# Altium schematic sheet ESC_D.SchDoc
size A3; SheetNumber: 10; SheetTotal: 10
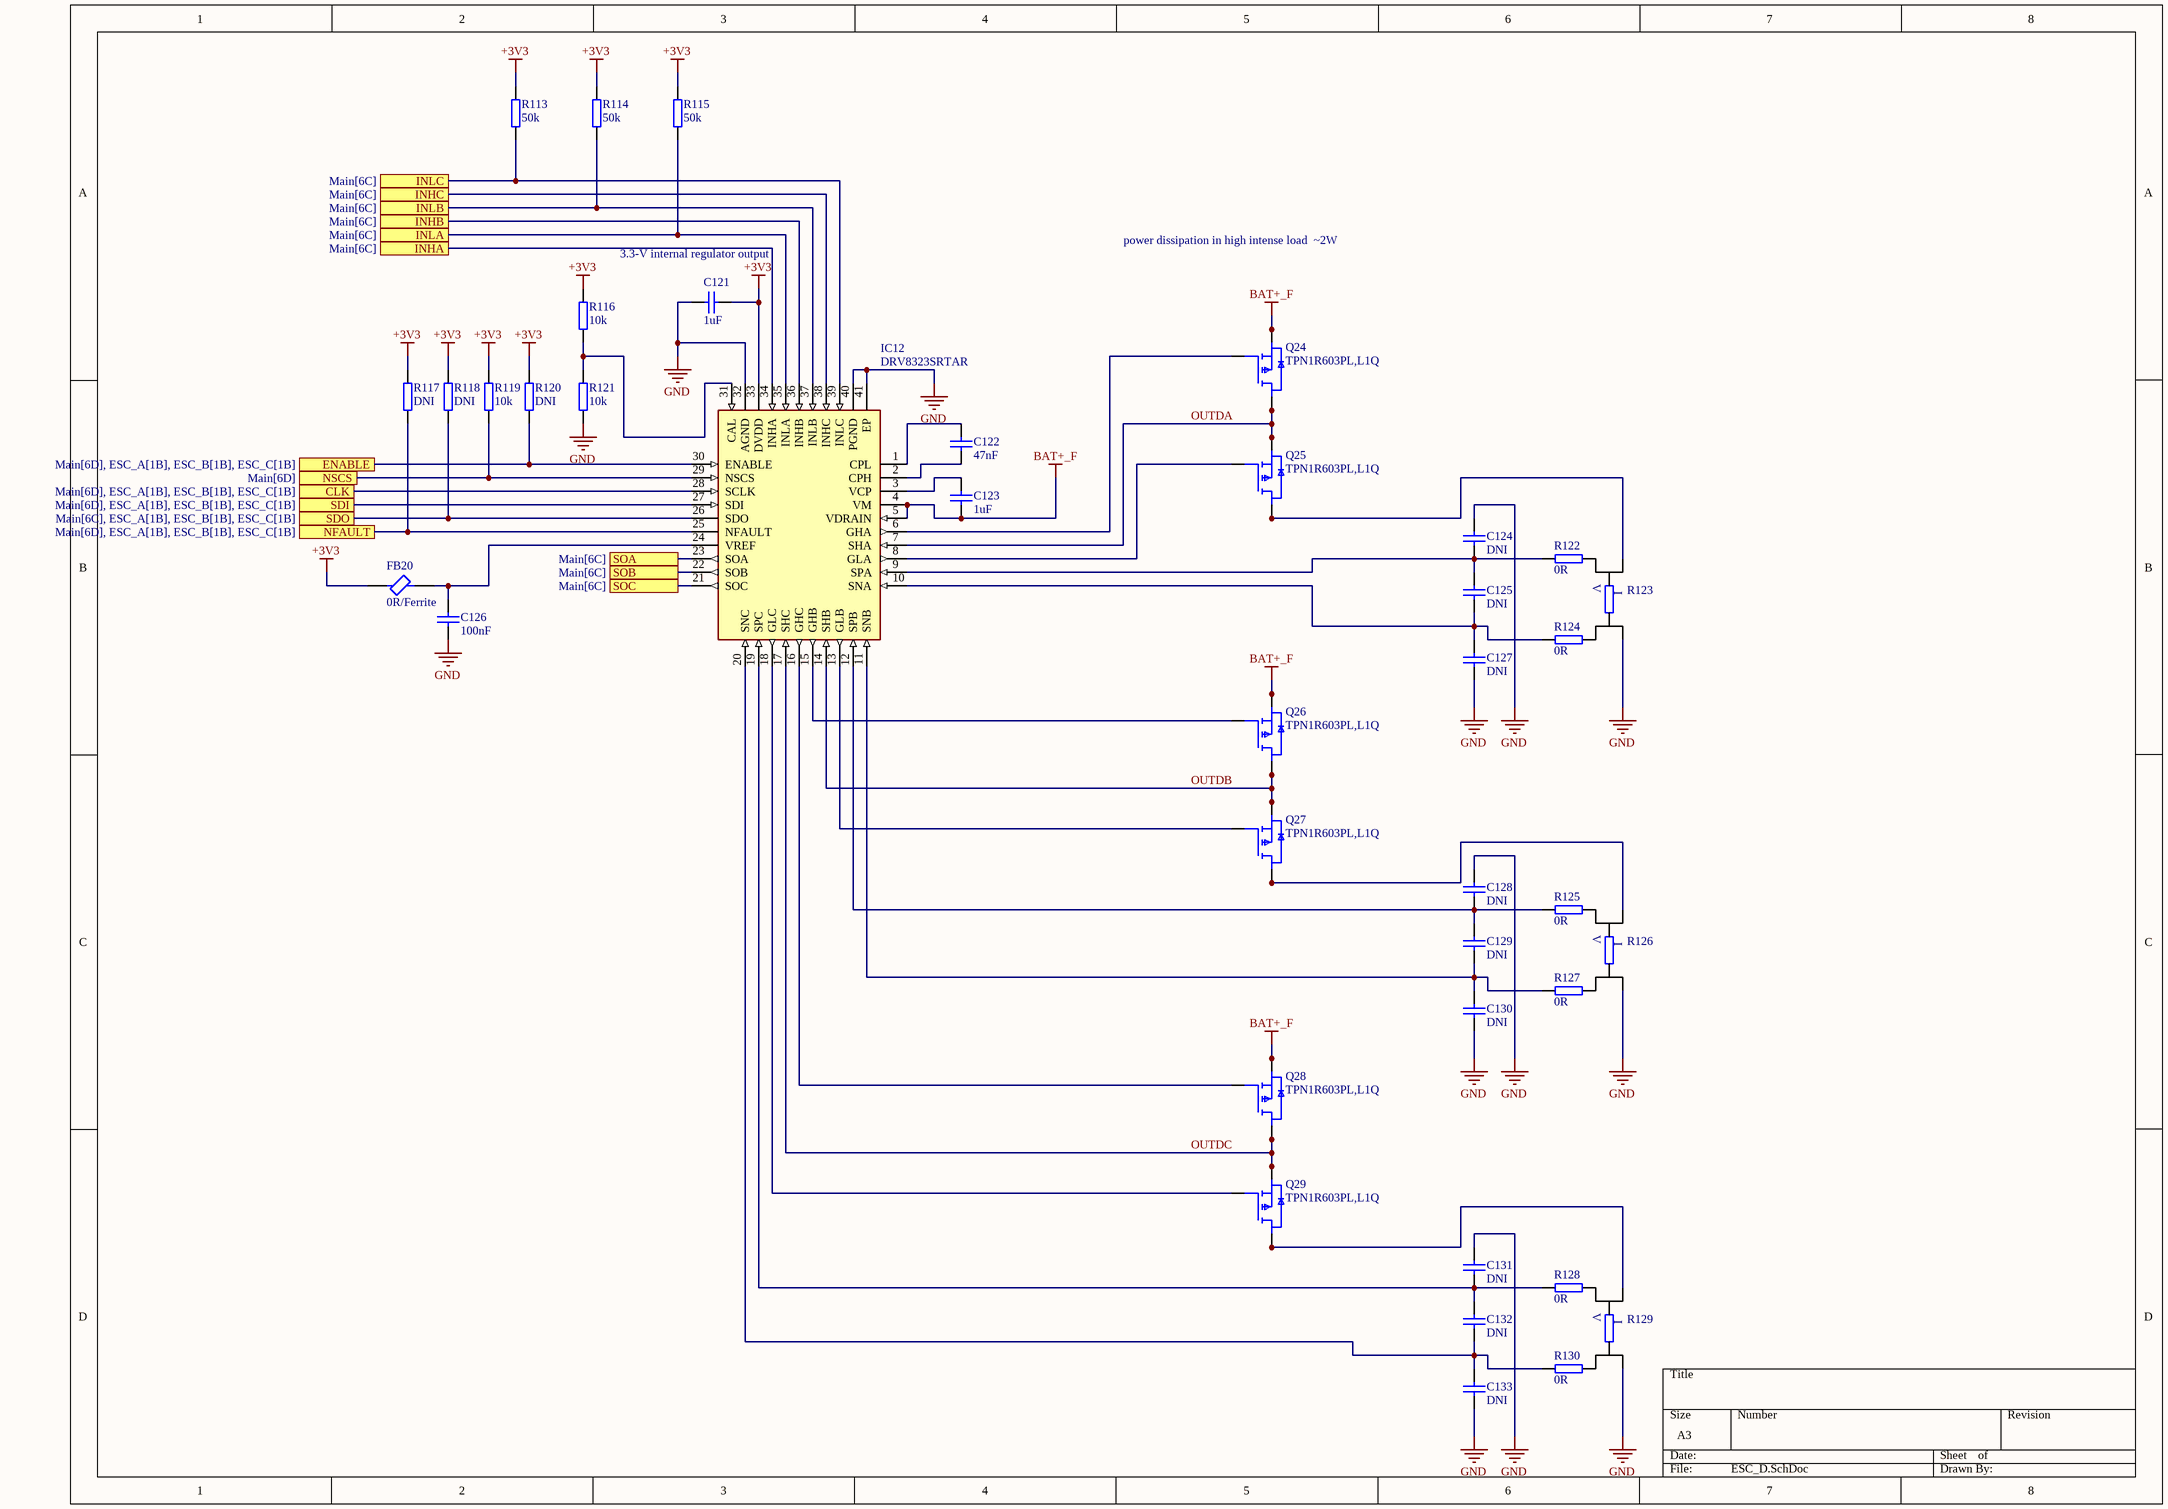
[diagram p0: ESC_D.SchDoc]

## Parts
C121  value 1uF  [CAP0402]  (hidden comment: Cap0402)
C122  value 47nF  [CAP0603]  (hidden comment: CapSMD0603)
C123  value 1uF  [CAP0603]  (hidden comment: CapSMD0603)
C124  value DNI  [CAP0402]  (hidden comment: Cap0402)
C125  value DNI  [CAP0402]  (hidden comment: Cap0402)
C126  value 100nF  [CAP0402]  (hidden comment: Cap0402)
C127  value DNI  [CAP0402]  (hidden comment: Cap0402)
C128  value DNI  [CAP0402]  (hidden comment: Cap0402)
C129  value DNI  [CAP0402]  (hidden comment: Cap0402)
C130  value DNI  [CAP0402]  (hidden comment: Cap0402)
C131  value DNI  [CAP0402]  (hidden comment: Cap0402)
C132  value DNI  [CAP0402]  (hidden comment: Cap0402)
C133  value DNI  [CAP0402]  (hidden comment: Cap0402)
FB20  0R/Ferrite  [NFZ15SG152SN10B]
IC12  DRV8323SRTAR  [QFN50P600X600X80-41N-D]
Q24  TPN1R603PL,L1Q  [TPN1R603PLL1Q]
Q25  TPN1R603PL,L1Q  [TPN1R603PLL1Q]
Q26  TPN1R603PL,L1Q  [TPN1R603PLL1Q]
Q27  TPN1R603PL,L1Q  [TPN1R603PLL1Q]
Q28  TPN1R603PL,L1Q  [TPN1R603PLL1Q]
Q29  TPN1R603PL,L1Q  [TPN1R603PLL1Q]
R113  value 50k  [RES0402]  (hidden comment: Res0402)
R114  value 50k  [RES0402]  (hidden comment: Res0402)
R115  value 50k  [RES0402]  (hidden comment: Res0402)
R116  value 10k  [RES0402]  (hidden comment: Res0402)
R117  value DNI  [RES0402]  (hidden comment: Res0402)
R118  value DNI  [RES0402]  (hidden comment: Res0402)
R119  value 10k  [RES0402]  (hidden comment: Res0402)
R120  value DNI  [RES0402]  (hidden comment: Res0402)
R121  value 10k  [RES0402]  (hidden comment: Res0402)
R122  value 0R  [RES0402]  (hidden comment: Res0402)
R123  WSK12161L000FEA  [WSK12161L000FEA]  (value not drawn)
R124  value 0R  [RES0402]  (hidden comment: Res0402)
R125  value 0R  [RES0402]  (hidden comment: Res0402)
R126  WSK12161L000FEA  [WSK12161L000FEA]  (value not drawn)
R127  value 0R  [RES0402]  (hidden comment: Res0402)
R128  value 0R  [RES0402]  (hidden comment: Res0402)
R129  WSK12161L000FEA  [WSK12161L000FEA]  (value not drawn)
R130  value 0R  [RES0402]  (hidden comment: Res0402)

## Ports
CLK (see Main[6D], ESC_A[1B], ESC_B[1B], ESC_C[1B]), ENABLE (see Main[6D], ESC_A[1B], ESC_B[1B], ESC_C[1B]), INHA (see Main[6C]), INHB (see Main[6C]), INHC (see Main[6C]), INLA (see Main[6C]), INLB (see Main[6C]), INLC (see Main[6C]), NFAULT (see Main[6D], ESC_A[1B], ESC_B[1B], ESC_C[1B]), NSCS (see Main[6D]), SDI (see Main[6D], ESC_A[1B], ESC_B[1B], ESC_C[1B]), SDO (see Main[6C], ESC_A[1B], ESC_B[1B], ESC_C[1B]), SOA (see Main[6C]), SOB (see Main[6C]), SOC (see Main[6C])

## Nets
+3V3: C121.2 FB20.1 IC12.33(DVDD) R113.2 R114.2 R115.2 R116.2 R117.2 R118.2 R119.2 R120.2
BAT+_F: C123.1 IC12.4(VM) IC12.5(VDRAIN) Q24.1(S_1) Q24.2(S_2) Q24.3(S_3) Q26.1(S_1) Q26.2(S_2) Q26.3(S_3) Q28.1(S_1) Q28.2(S_2) Q28.3(S_3)
GND: C121.1 C124.1 C126.1 C127.2 C128.1 C130.2 C131.1 C133.2 IC12.32(AGND) IC12.40(PGND) IC12.41(EP) R121.1 R123.4 R126.4 R129.4
CLK: IC12.28(SCLK) ; port CLK
ENABLE: IC12.30(ENABLE) R120.1 ; port ENABLE
INHA: IC12.34(INHA) ; port INHA
INHB: IC12.36(INHB) ; port INHB
INHC: IC12.38(INHC) ; port INHC
INLA: IC12.35(INLA) R115.1 ; port INLA
INLB: IC12.37(INLB) R114.1 ; port INLB
INLC: IC12.39(INLC) R113.1 ; port INLC
NFAULT: IC12.25(NFAULT) R117.1 ; port NFAULT
NSCS: IC12.29(NSCS) R119.1 ; port NSCS
OUTDA: IC12.7(SHA) Q24.5(D_1) Q24.6(D_2) Q24.7(D_3) Q24.8(D_4) Q24.9(D_4) Q25.1(S_1) Q25.2(S_2) Q25.3(S_3)
OUTDB: IC12.14(SHB) Q26.5(D_1) Q26.6(D_2) Q26.7(D_3) Q26.8(D_4) Q26.9(D_4) Q27.1(S_1) Q27.2(S_2) Q27.3(S_3)
OUTDC: IC12.17(SHC) Q28.5(D_1) Q28.6(D_2) Q28.7(D_3) Q28.8(D_4) Q28.9(D_4) Q29.1(S_1) Q29.2(S_2) Q29.3(S_3)
SDI: IC12.27(SDI) ; port SDI
SDO: IC12.26(SDO) R118.1 ; port SDO
SOA: IC12.23(SOA) ; port SOA
SOB: IC12.22(SOB) ; port SOB
SOC: IC12.21(SOC) ; port SOC
NetC122_1: C122.1 IC12.2(CPH)
NetC122_2: C122.2 IC12.1(CPL)
NetC123_2: C123.2 IC12.3(VCP)
NetC124_2: C124.2 C125.1 IC12.9(SPA) R122.1
NetC125_2: C125.2 C127.1 IC12.10(SNA) R124.1
NetC126_2: C126.2 FB20.2 IC12.24(VREF)
NetC128_2: C128.2 C129.1 IC12.12(SPB) R125.1
NetC129_2: C129.2 C130.1 IC12.11(SNB) R127.1
NetC131_2: C131.2 C132.1 IC12.19(SPC) R128.1
NetC132_2: C132.2 C133.1 IC12.20(SNC) R130.1
NetIC12_6: IC12.6(GHA) Q24.4(G)
NetIC12_8: IC12.8(GLA) Q25.4(G)
NetIC12_13: IC12.13(GLB) Q27.4(G)
NetIC12_15: IC12.15(GHB) Q26.4(G)
NetIC12_16: IC12.16(GHC) Q28.4(G)
NetIC12_18: IC12.18(GLC) Q29.4(G)
NetIC12_31: IC12.31(CAL) R116.1 R121.2
NetQ25_5: Q25.5(D_1) Q25.6(D_2) Q25.7(D_3) Q25.8(D_4) Q25.9(D_4) R123.1
NetQ27_5: Q27.5(D_1) Q27.6(D_2) Q27.7(D_3) Q27.8(D_4) Q27.9(D_4) R126.1
NetQ29_5: Q29.5(D_1) Q29.6(D_2) Q29.7(D_3) Q29.8(D_4) Q29.9(D_4) R129.1
NetR122_2: R122.2 R123.2
NetR123_3: R123.3 R124.2
NetR125_2: R125.2 R126.2
NetR126_3: R126.3 R127.2
NetR128_2: R128.2 R129.2
NetR129_3: R129.3 R130.2

## Notes on the sheet
- power dissipation in high intense load  ~2W
- 3.3-V internal regulator output
- (near IC12) Separate grounds?
- (in symbol WSK1216L5000FEA) V; I

## Library data of the parts
C121 = Cap0402: Voltage: val
C122 C123 = CapSMD0603: 50V; Published: 8-Jun-2000; LatestRevisionDate: 29-May-2009; LatestRevisionNote: IPC-7351 Footprint Added.; PackageReference: C1206; Publisher: Altium Limited; PackageDescription: Chip Capacitor
C126 = Cap0402: Voltage: 6V3
FB20 = BLM15PE471SH1D: Ferrite Bead; Manufacturer_Name: Murata Electronics; Datasheet Link: https://www.murata.com/en-global/products/productdetail.aspx?cate=luNoiseSupprFilteChipFerriBead&partno=BLM15PE471SH1%23; Height: 0.55mm; Manufacturer_Part_Number: BLM15PE471SH1D; Mouser Part Number: 81-BLM15PE471SH1D; Mouser Price/Stock: https://www.mouser.co.uk/ProductDetail/Murata-Electronics/BLM15PE471SH1D?qs=DRkmTr78QATAY5qAVx1hGA%3D%3D
IC12 = DRV8323SRTAR: Integrated Circuit; Manufacturer_Name: Texas Instruments; Datasheet Link: http://www.ti.com/lit/ds/symlink/drv8323.pdf; Height: 0.8mm; Manufacturer_Part_Number: DRV8323SRTAR; Mouser Part Number: 595-DRV8323SRTAR; Mouser Price/Stock: https://www.mouser.co.uk/ProductDetail/Texas-Instruments/DRV8323SRTAR?qs=u4fy%2FsgLU9P2gpPTX6mffg%3D%3D; Arrow Part Number: DRV8323SRTAR; Arrow Price/Stock: https://www.arrow.com/en/products/drv8323srtar/texas-instruments?utm_currency=USD&region=nac
Q24-Q29 = TPN1R603PL,L1Q: MOSFET (N-Channel); Manufacturer_Name: Toshiba; Datasheet Link: https://toshiba.semicon-storage.com/ap-en/semiconductor/product/mosfets/12v-300v-mosfets/detail.TPN1R603PL.html; Height: 0.9mm; Manufacturer_Part_Number: TPN1R603PL,L1Q; Mouser Part Number: 757-TPN1R603PLL1Q; Mouser Price/Stock: https://www.mouser.co.uk/ProductDetail/Toshiba/TPN1R603PLL1Q?qs=bUPhaerQQeGYpGlYi%252BLguw%3D%3D; Arrow Part Number: TPN1R603PL,L1Q; Arrow Price/Stock: https://www.arrow.com/en/products/tpn1r603pll1q/toshiba?utm_currency=USD&region=nac
R123 R126 R129 = WSK1216L5000FEA: Resistor; Manufacturer_Name: Vishay; Datasheet Link: http://www.vishay.com/docs/30189/wsk1216.pdf; Height: 1.9mm; Manufacturer_Part_Number: WSK1216L5000FEA; Mouser Part Number: 71-WSK1216L5000FEA; Mouser Price/Stock: https://www.mouser.co.uk/ProductDetail/Vishay-Dale/WSK1216L5000FEA?qs=OlC7AqGiEDlM2wGD42LFoQ%3D%3D; Arrow Part Number: WSK1216L5000FEA; Arrow Price/Stock: https://www.arrow.com/en/products/wsk1216l5000fea/vishay?region=nac
C124 C125 C127-C133 = Cap0402: Voltage: DNI